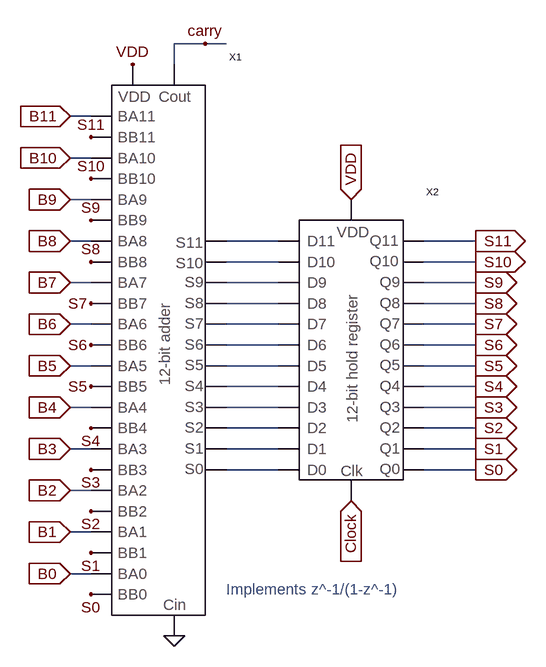
[diagram p0: schematic 12_bit_Accumulator.asc]
12_bit_Accumulator.asc, the LTspice schematic file:
Version 4
SHEET 1 1900 932
WIRE 288 -1152 240 -1152
WIRE 320 -1152 288 -1152
WIRE 240 -1120 240 -1152
WIRE 112 -1040 80 -1040
WIRE 112 -976 80 -976
WIRE 112 -912 80 -912
WIRE 112 -848 80 -848
WIRE 400 -848 320 -848
WIRE 704 -848 624 -848
WIRE 400 -816 320 -816
WIRE 704 -816 624 -816
WIRE 112 -784 80 -784
WIRE 400 -784 320 -784
WIRE 704 -784 624 -784
WIRE 400 -752 320 -752
WIRE 704 -752 624 -752
WIRE 112 -720 80 -720
WIRE 400 -720 320 -720
WIRE 704 -720 624 -720
WIRE 400 -688 320 -688
WIRE 704 -688 624 -688
WIRE 112 -656 80 -656
WIRE 400 -656 320 -656
WIRE 704 -656 624 -656
WIRE 400 -624 320 -624
WIRE 704 -624 624 -624
WIRE 112 -592 80 -592
WIRE 400 -592 320 -592
WIRE 704 -592 624 -592
WIRE 400 -560 320 -560
WIRE 704 -560 624 -560
WIRE 112 -528 80 -528
WIRE 400 -528 320 -528
WIRE 704 -528 624 -528
WIRE 400 -496 320 -496
WIRE 704 -496 624 -496
WIRE 112 -464 80 -464
WIRE 112 -400 80 -400
WIRE 112 -336 80 -336
FLAG 80 -784 B7
IOPIN 80 -784 In
FLAG 80 -720 B6
IOPIN 80 -720 In
FLAG 80 -656 B5
IOPIN 80 -656 In
FLAG 80 -592 B4
IOPIN 80 -592 In
FLAG 80 -528 B3
IOPIN 80 -528 In
FLAG 80 -464 B2
IOPIN 80 -464 In
FLAG 80 -400 B1
IOPIN 80 -400 In
FLAG 80 -336 B0
IOPIN 80 -336 In
FLAG 80 -976 B10
IOPIN 80 -976 In
FLAG 80 -912 B9
IOPIN 80 -912 In
FLAG 80 -848 B8
IOPIN 80 -848 In
FLAG 176 -1120 VDD
FLAG 240 -240 0
FLAG 512 -912 VDD
IOPIN 512 -912 In
FLAG 512 -448 Clock
IOPIN 512 -448 In
FLAG 704 -816 S10
IOPIN 704 -816 Out
FLAG 704 -784 S9
IOPIN 704 -784 Out
FLAG 704 -752 S8
IOPIN 704 -752 Out
FLAG 704 -720 S7
IOPIN 704 -720 Out
FLAG 704 -688 S6
IOPIN 704 -688 Out
FLAG 704 -656 S5
IOPIN 704 -656 Out
FLAG 704 -624 S4
IOPIN 704 -624 Out
FLAG 704 -592 S3
IOPIN 704 -592 Out
FLAG 704 -560 S2
IOPIN 704 -560 Out
FLAG 704 -528 S1
IOPIN 704 -528 Out
FLAG 704 -496 S0
IOPIN 704 -496 Out
FLAG 288 -1152 carry
FLAG 112 -1008 S11
FLAG 112 -944 S10
FLAG 112 -880 S9
FLAG 112 -816 S8
FLAG 112 -752 S7
FLAG 112 -688 S6
FLAG 112 -624 S5
FLAG 112 -560 S4
FLAG 112 -496 S3
FLAG 112 -432 S2
FLAG 112 -368 S1
FLAG 112 -304 S0
FLAG 80 -1040 B11
IOPIN 80 -1040 In
FLAG 704 -848 S11
IOPIN 704 -848 Out
SYMBOL 12_bit_adder 144 -272 R0
SYMATTR InstName X1
SYMBOL 12_bit_register 432 -480 R0
SYMATTR InstName X2
TEXT 320 -312 Left 0 ;Implements z^-1/(1-z^-1)

The netlist it stands for:
* 12_bit_Accumulator.asc
XX1 VDD B0 S0 B1 S1 B2 S2 B3 S3 B4 S4 B5 S5 B6 S6 B7 S7 N012 carry 0 N011 N010 N009 N008 N007 N006 N005 N004 N003 N002 N001 B8 S8 B9 S9 B10 S10 B11 S11 12_bit_adder  ; pins VDD BA0 BB0 BA1 BB1 BA2 BB2 BA3 BB3 BA4 BB4 BA5 BB5 BA6 BB6 BA7 BB7 S0 Cout Cin S1 S2 S3 S4 S5 S6 S7 S8 S9 S10 S11 BA8 BB8 BA9 BB9 BA10 BB10 BA11 BB11
XX2 N012 N011 N010 N009 N008 N007 N006 N005 N004 N003 N002 N001 S0 S1 S2 S3 S4 S5 S6 S7 S8 S9 S10 S11 Clock VDD 12_bit_register  ; pins D0 D1 D2 D3 D4 D5 D6 D7 D8 D9 D10 D11 Q0 Q1 Q2 Q3 Q4 Q5 Q6 Q7 Q8 Q9 Q10 Q11 Clk VDD
* Implements z^-1/(1-z^-1)
.backanno
.end